# EAGLE design PCB-SLIDER45 (EAGLE 6.4)
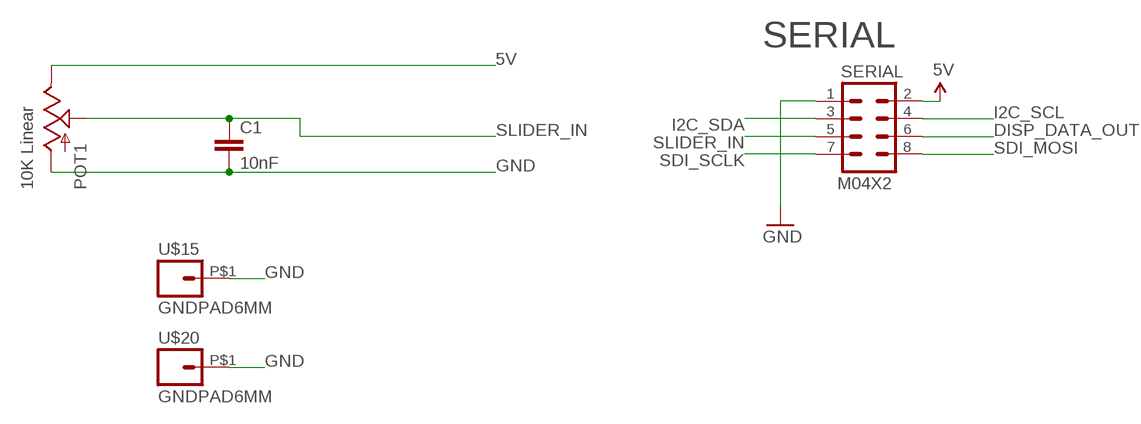
[diagram p0: schematic, sheet 1]

## Parts
C1  10nF  CAP0603-CAP  [0603-CAP]
POT1  10K Linear  SLIDER45  [SLIDER45]
SERIAL  M04X2  [2X4]
U$15  GNDPAD6MM  [3.2MMPAD6MM]
U$20  GNDPAD6MM  [3.2MMPAD6MM]

## Nets
5V [Power]: POT1.1(E) SERIAL.2
DISP_DATA_OUT: SERIAL.6
GND [Power]: C1.2 POT1.3(A) SERIAL.1 U$15.P$1 U$20.P$1
I2C_SCL: SERIAL.4
I2C_SDA: SERIAL.3
SDI_MOSI: SERIAL.8
SDI_SCLK: SERIAL.7
SLIDER_IN: C1.1 POT1.2A(S) SERIAL.5

## Notes on the sheet
- SERIAL

## Library data of the parts
C1 = SparkFun:CAP: Capacitor Standard 0603 ceramic capacitor, and 0.1" leaded capacitor.
POT1 = SKAARHOJ:SLIDER
SERIAL = SparkFun:M04X2
U$15 U$20 = SKAARHOJ:GNDPAD

## Net classes
0 default: width 0.203 mm, drill 0.406 mm, clearance 0.203 mm
1 Power: width 0.406 mm, drill 0.61 mm, clearance 0.203 mm

## Board
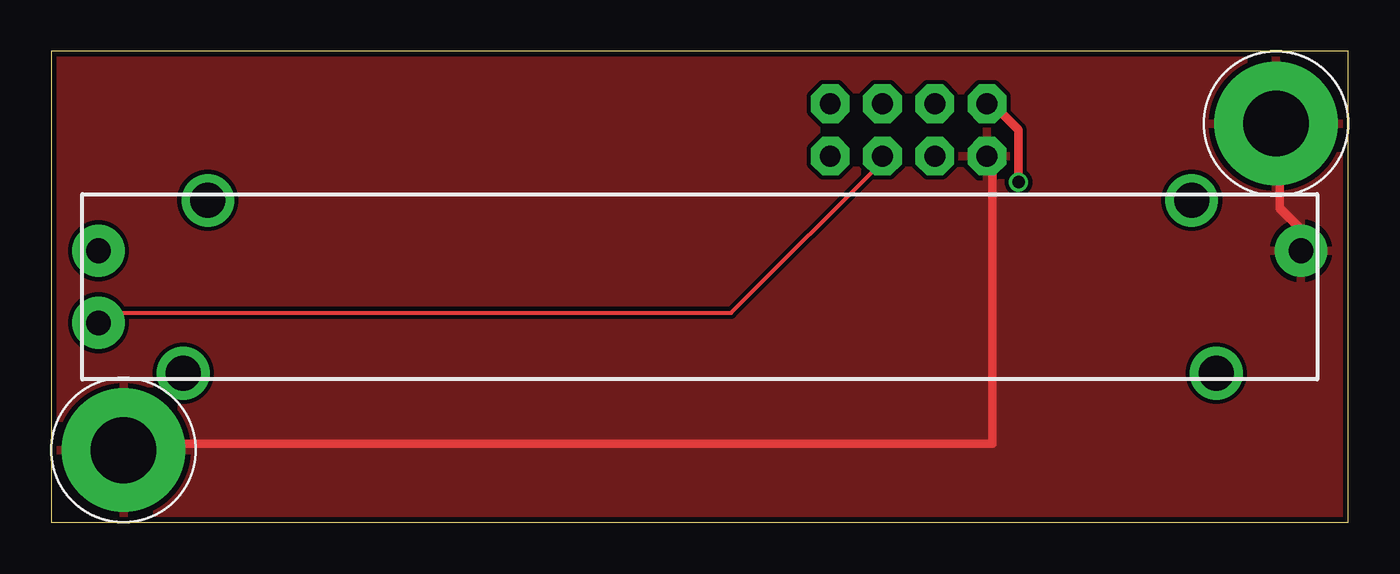
[diagram p1: board, top side]
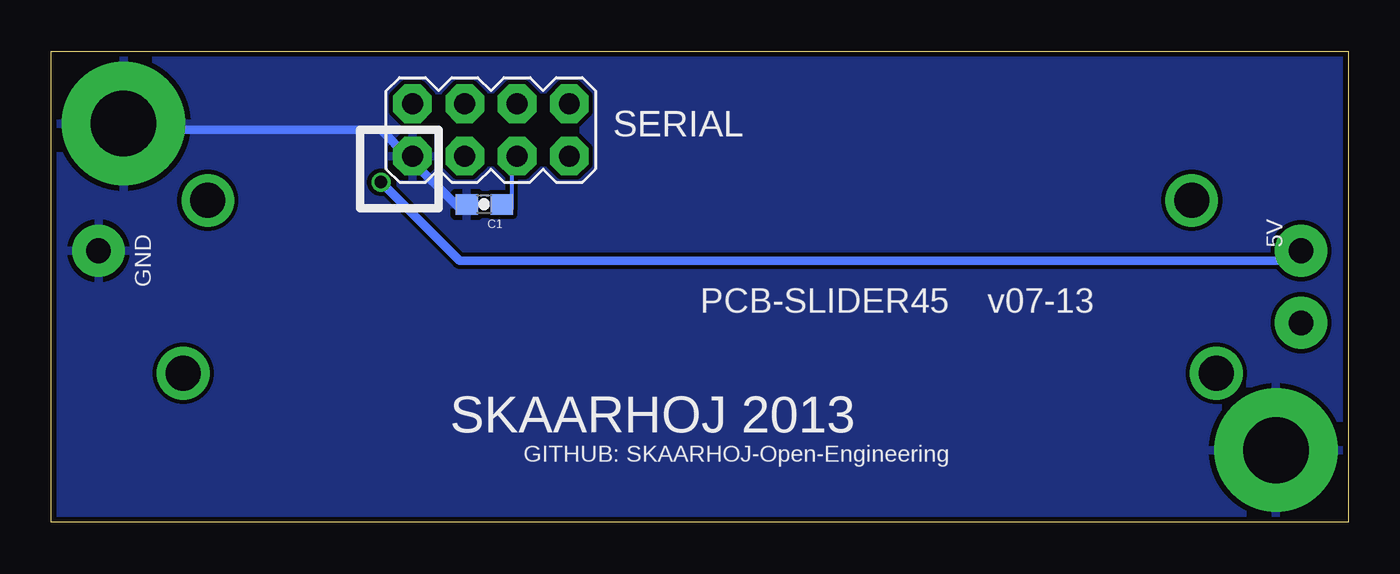
[diagram p2: board, bottom side, seen from below]

Size 63 x 22.86 mm. Coordinates in mm from the lower left corner, seen from the top.
Outline: 0,0 63,0 63,22.86 0,22.86 0,0
Copper layers (1*16): Top 0.035mm / dielectric 1.5mm / Bottom 0.035mm
Design rules "Fusion_eagle_rule_v1.1": minimum track width 6mil, minimum drill 12mil, track to track 6mil, track to pad 6mil, pad to pad 6mil, via to via 6mil, smd to smd 0mil, copper to edge 10mil, drill to drill 10mil, minimum pad ring 10mil, minimum via ring 6mil, stop-mask expansion 2mil, vias tented up to drill 100mil, thermal gap 10mil

### Footprints (pad centres in the part's own frame; a part is rotated, then mirrored left to right if it is on the bottom)
0603-CAP = smd 1.1 x 1: 1 -0.85,0; 2 0.85,0
SLIDER45 = drill 1.194 pad 2.54: 1 -29.21,1.75; 2A -29.21,-1.75; 3 29.21,1.75 | drill 1.702: P$1 -23.9,4.2; P$2 23.9,4.2; P$3 25.1,-4.2; P$4 -25.1,-4.2
2X4 = drill 1.016 pad 1.88 octagon: 1 -3.81,-1.27; 2 -3.81,1.27; 3 -1.27,-1.27; 4 -1.27,1.27; 5 1.27,-1.27; 6 1.27,1.27; 7 3.81,-1.27; 8 3.81,1.27
3.2MMPAD6MM = drill 3.2 pad 6: P$1 0,0

### Placement (x,y rotation side)
C1  41.98,15.44 180 bottom
POT1  31.5,11.43 0 top
SERIAL  41.65,19.05 0 bottom
U$15  3.5,3.5 0 top
U$20  59.5,19.36 0 top

### Tracks (layer width: path | path; a pad name or v marks a point on that pad's centre or on a via)
5V  (via drill 0.61)
  Top 0.406: v46.99,16.51 46.99,19.05 45.72,20.32 SERIAL.2
  Bottom 0.406: v46.99,16.51 43.18,12.7 2.54,12.7 POT1.1
GND
  Top 0.406: POT1.3 60.96,13.97 59.69,15.24 59.69,19.05 U$20.P$1 | U$15.P$1 3.81,3.81 45.72,3.81 45.72,17.78 SERIAL.1
  Bottom 0.406: 45.72,17.78 43.18,15.24 C1.2 | 45.72,17.78 46.99,19.05 58.42,19.05 U$20.P$1 | 45.72,17.78 SERIAL.1
  pour Top: 0,0 63,0 63,23 0,23
  pour Bottom: 0,0 63,0 63,23 0,23
SLIDER_IN
  Top 0.203: SERIAL.5 40.64,17.78 33.02,10.16 2.54,10.16 POT1.2A
  Bottom 0.203: C1.1 40.64,15.24 40.64,17.78 SERIAL.5

### Text on the board
_bsilk: 5V | GND | PCB-SLIDER45 v07-13 | SKAARHOJ 2013 | GITHUB: SKAARHOJ-Open-Engineering